# Altium schematic sheet HardwareV2 - 副本.SchDoc
size A4
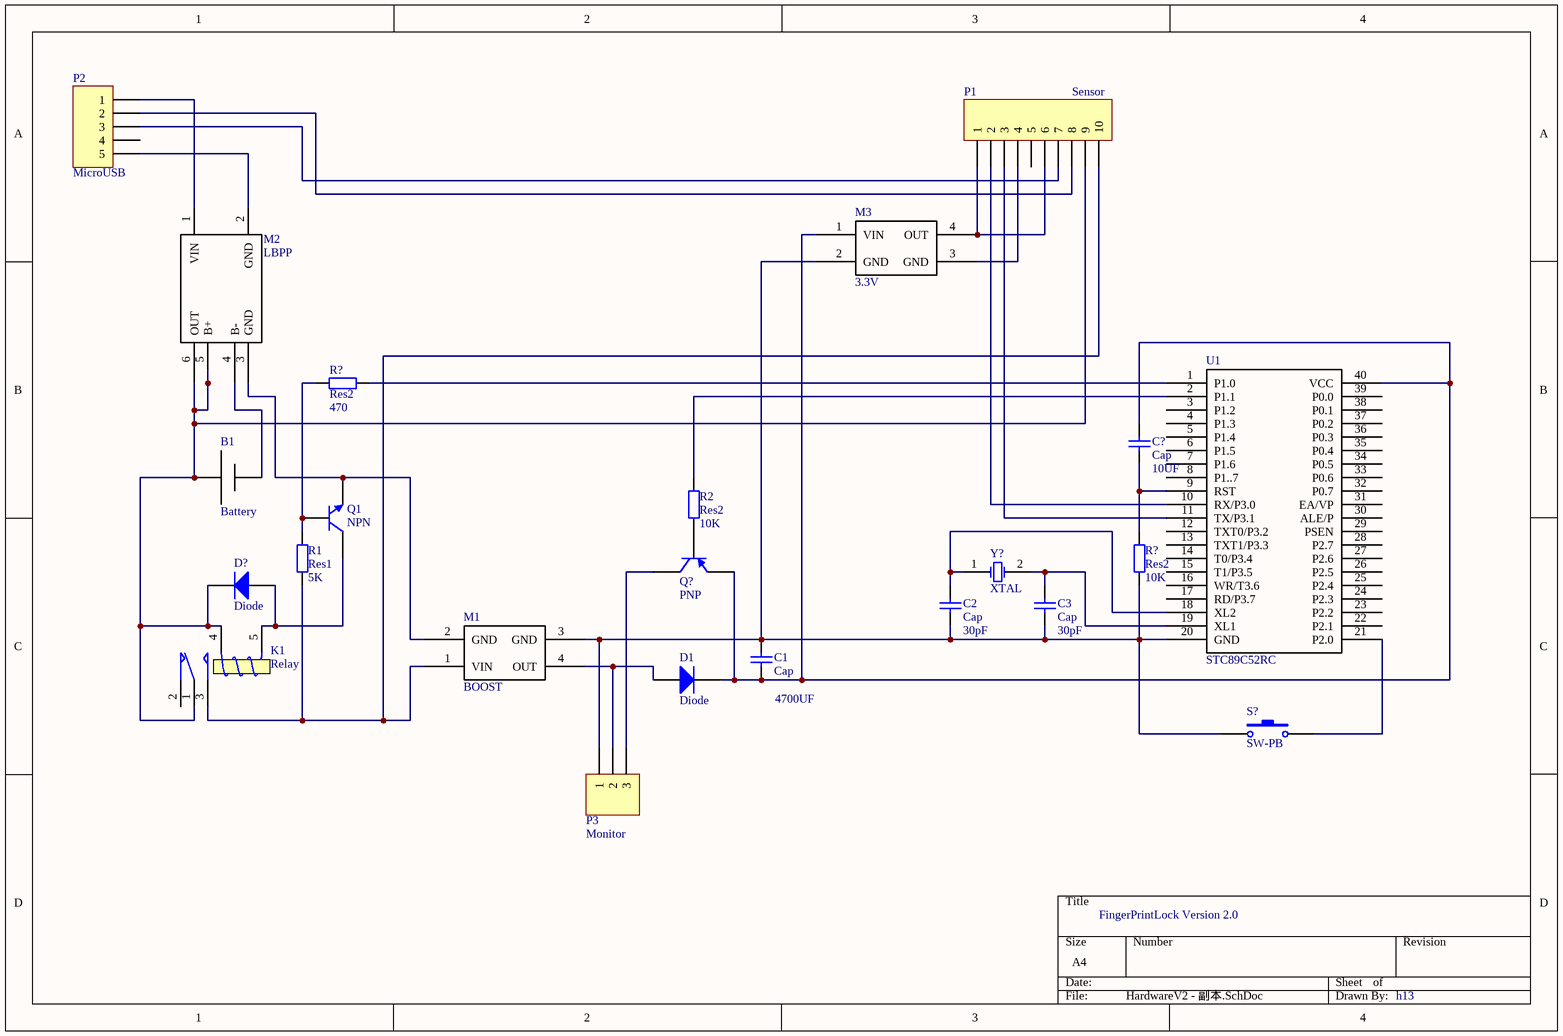
[diagram p0: HardwareV2 - 副本.SchDoc]

## Parts
(Parts that share a designator on the sheet are numbered #1, #2 ... from top to bottom, then left to right.)
B1  Battery
C1  Cap  value 4700UF  [RAD-0.3]
C2  Cap  value 30pF  [RAD-0.3]
C3  Cap  value 30pF  [RAD-0.3]
C?  Cap  value 10UF  [RAD-0.3]
D1  Diode  [SMC]
D?  Diode  [SMC]
K1  Relay  [MODULE5B]
M1  BOOST
M2  LBPP
M3  3.3V
P1  Sensor  [HDR1X10]
P2  MicroUSB  [HDR1X5]
P3  Monitor  [HDR1X3]
Q1  NPN  [TO-226-AA]
Q?  PNP  [SOT-23B_N]
R1  Res1  value 5K  [AXIAL-0.4]
R2  Res2  value 10K  [AXIAL-0.4]
R?#1  Res2  value 470  [AXIAL-0.4]
R?#2  Res2  value 10K  [AXIAL-0.4]
S?  SW-PB  [SPST-2]
U1  STC89C52RC
Y?  XTAL  [R38]

## Nets
NetB1_1: B1.1(V+) D?.2(K) K1.1(COM) K1.4(T1) M2.5(B+) M2.6(OUT) P1.9
NetB1_2: B1.2(GND) M2.4(B-)
NetC1_1: C1.1 C?.2 D1.2(K) M3.1(VIN) Q?.3(E) U1.40(VCC)
NetC1_2: C1.2 C2.1 C3.1 M1.3(GND) M3.2(GND) P3.1 R?#2.1 S?.1 U1.20(GND)
NetC2_2: C2.2 U1.18(XL2) Y?.1(OSC1)
NetC3_2: C3.2 U1.19(XL1) Y?.2(OSC2)
NetC?_1: C?.1 R?#2.2 U1.9(RST)
NetD1_1: D1.1(A) M1.4(OUT) P3.2
NetD?_1: D?.1(A) K1.5(T2) Q1.1(C)
NetK1_3: K1.3(NO) M1.1(VIN) P1.10 R1.1
NetM1_2: M1.2(GND) M2.3(GND) Q1.3(E)
NetM2_1: M2.1(VIN) P2.1
NetM2_2: M2.2(GND) P2.5
NetM3_3: M3.3(GND) P1.4
NetM3_4: M3.4(OUT) P1.1 P1.6
NetP1_2: P1.2 U1.10(RX/P3.0)
NetP1_3: P1.3 U1.11(TX/P3.1)
NetP1_7: P1.7 P2.3
NetP1_8: P1.8 P2.2
NetP3_3: P3.3 Q?.1(C)
NetQ1_2: Q1.2(B) R1.2 R?#1.2
NetQ?_2: Q?.2(B) R2.1
NetR2_2: R2.2 U1.2(P1.1)
NetR?#1_1: R?#1.1 U1.1(P1.0)
NetS?_2: S?.2 U1.21(P2.0)

Not connected (* = marked no-connect by the designer): K1 2(NC); P1 5; P2 4; U1 3(P1.2) 4(P1.3) 5(P1.4) 6(P1.5) 7(P1.6) 8(P1..7) 12(TXT0/P3.2) 13(TXT1/P3.3) 14(T0/P3.4) 15(T1/P3.5) 16(WR/T3.6) 17(RD/P3.7) 22(P2.1) 23(P2.2) 24(P2.3) 25(P2.4) 26(P2.5) 27(P2.6) 28(P2.7) 29(PSEN) 30(ALE/P) 31(EA/VP) 32(P0.7) 33(P0.6) 34(P0.5) 35(P0.4) 36(P0.3) 37(P0.2) 38(P0.1) 39(P0.0)

## Notes on the sheet
- FingerPrintLock Version 2.0
- h13

## Library data of the parts
C1-C3 C? = Cap: Capacitor; Published: 8-Jun-2000; LatestRevisionDate: 17-Jul-2002; LatestRevisionNote: Re-released for DXP Platform.; PackageReference: RAD-0.3; Publisher: Altium Limited; PackageDescription: Radial Cap, Thru-Hole; 2 Leads; 0.3 in Pin Spacing
D1 D? = Diode: Default Diode; Published: 8-Jun-2000; LatestRevisionDate: 17-Jul-2002; LatestRevisionNote: Re-released for DXP Platform.; PackageVersion: Sep-1996; PackageReference: SMC; Publisher: Altium Limited; PackageDescription: DO-214-AB/SMC; 2 C-Bend Leads; Body 7.9 x 5.9 mm, inc. leads (LxW); Code_JEDEC: DO-214-AB
K1 = Relay: SPDT Relay; Published: 8-Jun-2000; LatestRevisionDate: 17-Jul-2002; LatestRevisionNote: Re-released for DXP Platform.; PackageReference: MODULE5B; Publisher: Altium Limited
P1 = Header 10: Header, 10-Pin; LatestRevisionDate: 17-Jul-2002; LatestRevisionNote: Re-released for DXP Platform.; Publisher: Altium Limited
P2 = Header 5: Header, 5-Pin; LatestRevisionDate: 17-Jul-2002; LatestRevisionNote: Re-released for DXP Platform.; Publisher: Altium Limited
P3 = Header 3: Header, 3-Pin; LatestRevisionDate: 17-Jul-2002; LatestRevisionNote: Re-released for DXP Platform.; Publisher: Altium Limited
Q1 = NPN: NPN Bipolar Transistor; Published: 8-Jun-2000; LatestRevisionDate: 17-Jul-2002; LatestRevisionNote: Re-released for DXP Platform.; PackageReference: TO-226-AA; Publisher: Altium Limited; PackageDescription: TO, Flat Index; 3 In-Line, Axial Leads; Body Dia. 4.8mm; Leads 0.55 x 0.51 mm (max); Code_JEDEC: TO-226-AA
Q? = PNP: PNP Bipolar Transistor; Published: 8-Jun-2000; LatestRevisionDate: 29-May-2009; LatestRevisionNote: IPC-7351 Footprint Added.; PackageVersion: Aug-1999; PackageReference: SOT-23B; Publisher: Altium Limited; PackageDescription: 3-Pin SOT-23 Package 0.95 mm Pitch, 2.4 mm Lead Span
R1 R2 R?#1 R?#2 = Res2: Resistor; Published: 8-Jun-2000; LatestRevisionDate: 17-Jul-2002; LatestRevisionNote: Re-released for DXP Platform.; PackageReference: AXIAL-0.4; Publisher: Altium Limited; PackageDescription: Axial Device, Thru-Hole; 2 Leads; 0.4 in Pin Spacing
S? = SW-PB: Switch; Published: 24-Mar-1999; LatestRevisionDate: 17-Jul-2002; LatestRevisionNote: Re-released for DXP Platform.; PackageReference: SPST-2; Publisher: Altium Limited; PackageDescription: Switch; 2 Leads
Y? = XTAL: Crystal Oscillator; Published: 8-Jun-2000; LatestRevisionDate: 17-Jul-2002; LatestRevisionNote: Re-released for DXP Platform.; PackageReference: R38; Publisher: Altium Limited; PackageDescription: Crystal, Thru-Hole; 2 Leads; Body 3.1 x 8.2 mm (Dia.xH)